# Altium schematic sheet G7SA-2A2B.SchDoc
size A
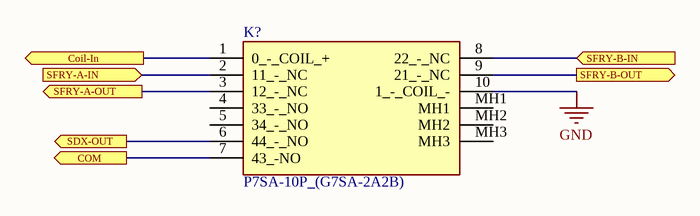
[diagram p0: G7SA-2A2B.SchDoc]

## Parts
K?  P7SA-10P_(G7SA-2A2B)  [P7SA10PG7SA2A2B]

## Ports
Coil-In (out), COM (out), SDX-OUT (out), SFRY-A-IN (in), SFRY-A-OUT (out), SFRY-B-IN (in), SFRY-B-OUT (out)

## Nets
GND: K?.10(1_-_COIL_-)
Coil-In: K?.1(0_-_COIL_+) ; port Coil-In
COM: K?.7(43_-NO) ; port COM
SDX-OUT: K?.6(44_-_NO) ; port SDX-OUT
SFRY-A-IN: K?.2(11_-_NC) ; port SFRY-A-IN
SFRY-A-OUT: K?.3(12_-_NC) ; port SFRY-A-OUT
SFRY-B-IN: K?.8(22_-_NC) ; port SFRY-B-IN
SFRY-B-OUT: K?.9(21_-_NC) ; port SFRY-B-OUT

Not connected (* = marked no-connect by the designer): K? 4(33_-_NO) 5(34_-_NO) MH1 MH2 MH3

## Library data of the parts
K? = P7SA-10P_(G7SA-2A2B): Relay or Contactor; Manufacturer_Name: Omron Electronics; Manufacturer_Part_Number: P7SA-10P (G7SA-2A2B); Datasheet Link: http://www.ia.omron.com/data_pdf/cat/g7sa_j120-e1_12_1_csm1269.pdf